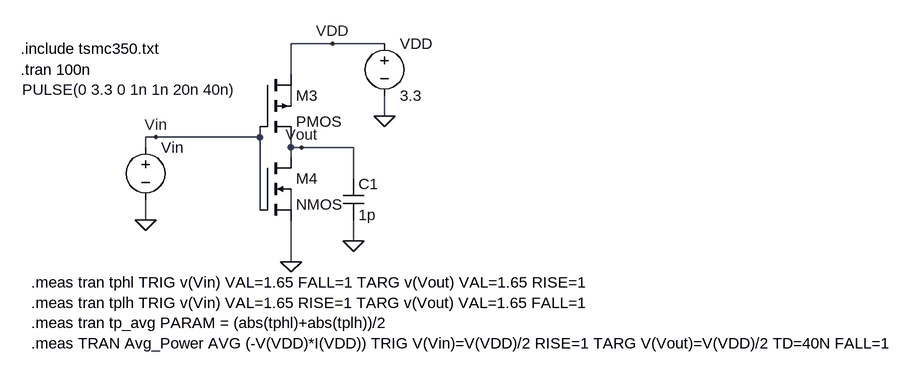
[diagram p0: schematic lab2-task4.asc]
lab2-task4.asc, the LTspice schematic file:
Version 4
SHEET 1 1292 680
WIRE 432 192 368 192
WIRE 512 192 432 192
WIRE 368 240 368 192
WIRE 368 288 368 256
WIRE 512 304 512 272
WIRE 160 336 144 336
WIRE 320 336 320 320
WIRE 320 336 160 336
WIRE 144 352 144 336
WIRE 368 352 368 336
WIRE 384 352 368 352
WIRE 464 352 384 352
WIRE 368 368 368 352
WIRE 464 400 464 352
WIRE 320 448 320 336
WIRE 368 448 368 416
WIRE 144 464 144 432
WIRE 464 496 464 464
WIRE 368 528 368 464
FLAG 144 464 0
FLAG 512 304 0
FLAG 368 528 0
FLAG 464 496 0
FLAG 160 336 Vin
FLAG 384 352 Vout
FLAG 432 192 VDD
SYMBOL Voltage 512 176 R0
SYMATTR InstName VDD
SYMATTR Value 3.3
SYMBOL Voltage 144 336 R0
WINDOW 3 -190 -73 Left 2
SYMATTR Value PULSE(0 3.3 0 1n 1n 20n 40n)
SYMATTR InstName Vin
SYMBOL Cap 448 400 R0
SYMATTR InstName C1
SYMATTR Value 1p
SYMBOL pmos4 320 240 R0
SYMATTR InstName M3
SYMATTR Value2 l=350n w=2.5u
SYMBOL nmos4 320 368 R0
SYMATTR InstName M4
SYMATTR Value2 l=350n w=1u
TEXT -48 232 Left 2 !.tran 100n
TEXT -48 200 Left 2 !.include tsmc350.txt
TEXT -32 560 Left 2 !.meas tran tphl TRIG v(Vin) VAL=1.65 FALL=1 TARG v(Vout) VAL=1.65 RISE=1\n.meas tran tplh TRIG v(Vin) VAL=1.65 RISE=1 TARG v(Vout) VAL=1.65 FALL=1\n.meas tran tp_avg PARAM = (abs(tphl)+abs(tplh))/2\n.meas TRAN Avg_Power AVG (-V(VDD)*I(VDD)) TRIG V(Vin)=V(VDD)/2 RISE=1 TARG V(Vout)=V(VDD)/2 TD=40N FALL=1

The netlist it stands for:
* lab2-task4.asc
VDD VDD 0 3.3
Vin Vin 0 PULSE(0 3.3 0 1n 1n 20n 40n)
C1 Vout 0 1p
M3 VDD Vin Vout N001 PMOS l=350n w=2.5u
M4 Vout Vin 0 N002 NMOS l=350n w=1u
.model NMOS NMOS
.model PMOS PMOS
.lib standard.mos
.tran 100n
.include tsmc350.txt
.meas tran tphl TRIG v(Vin) VAL=1.65 FALL=1 TARG v(Vout) VAL=1.65 RISE=1
.meas tran tplh TRIG v(Vin) VAL=1.65 RISE=1 TARG v(Vout) VAL=1.65 FALL=1
.meas tran tp_avg PARAM = (abs(tphl)+abs(tplh))/2
.meas TRAN Avg_Power AVG (-V(VDD)*I(VDD)) TRIG V(Vin)=V(VDD)/2 RISE=1 TARG V(Vout)=V(VDD)/2 TD=40N FALL=1
.backanno
.end